# EAGLE schematic Spartan3E_DevBoard-v22 (EAGLE 5.00)
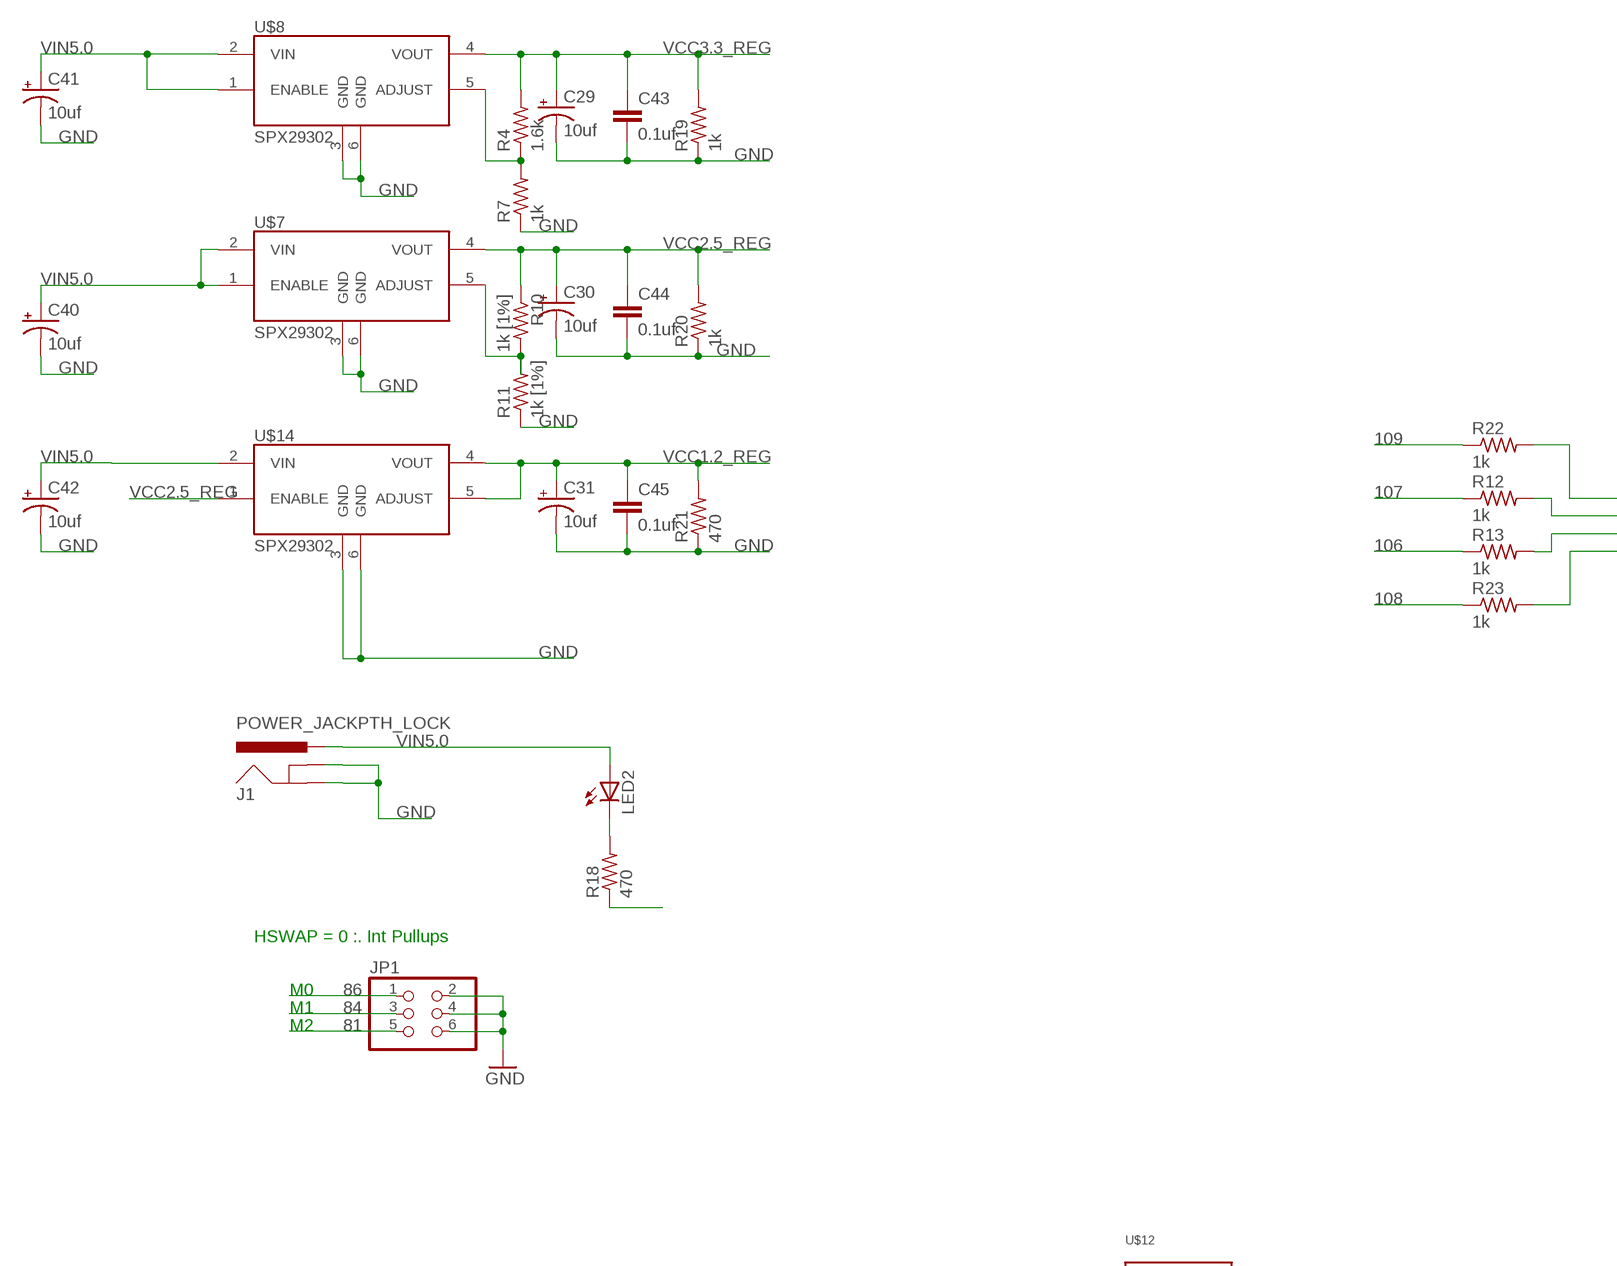
[diagram p0: schematic, sheet 1, part 1 of 3]
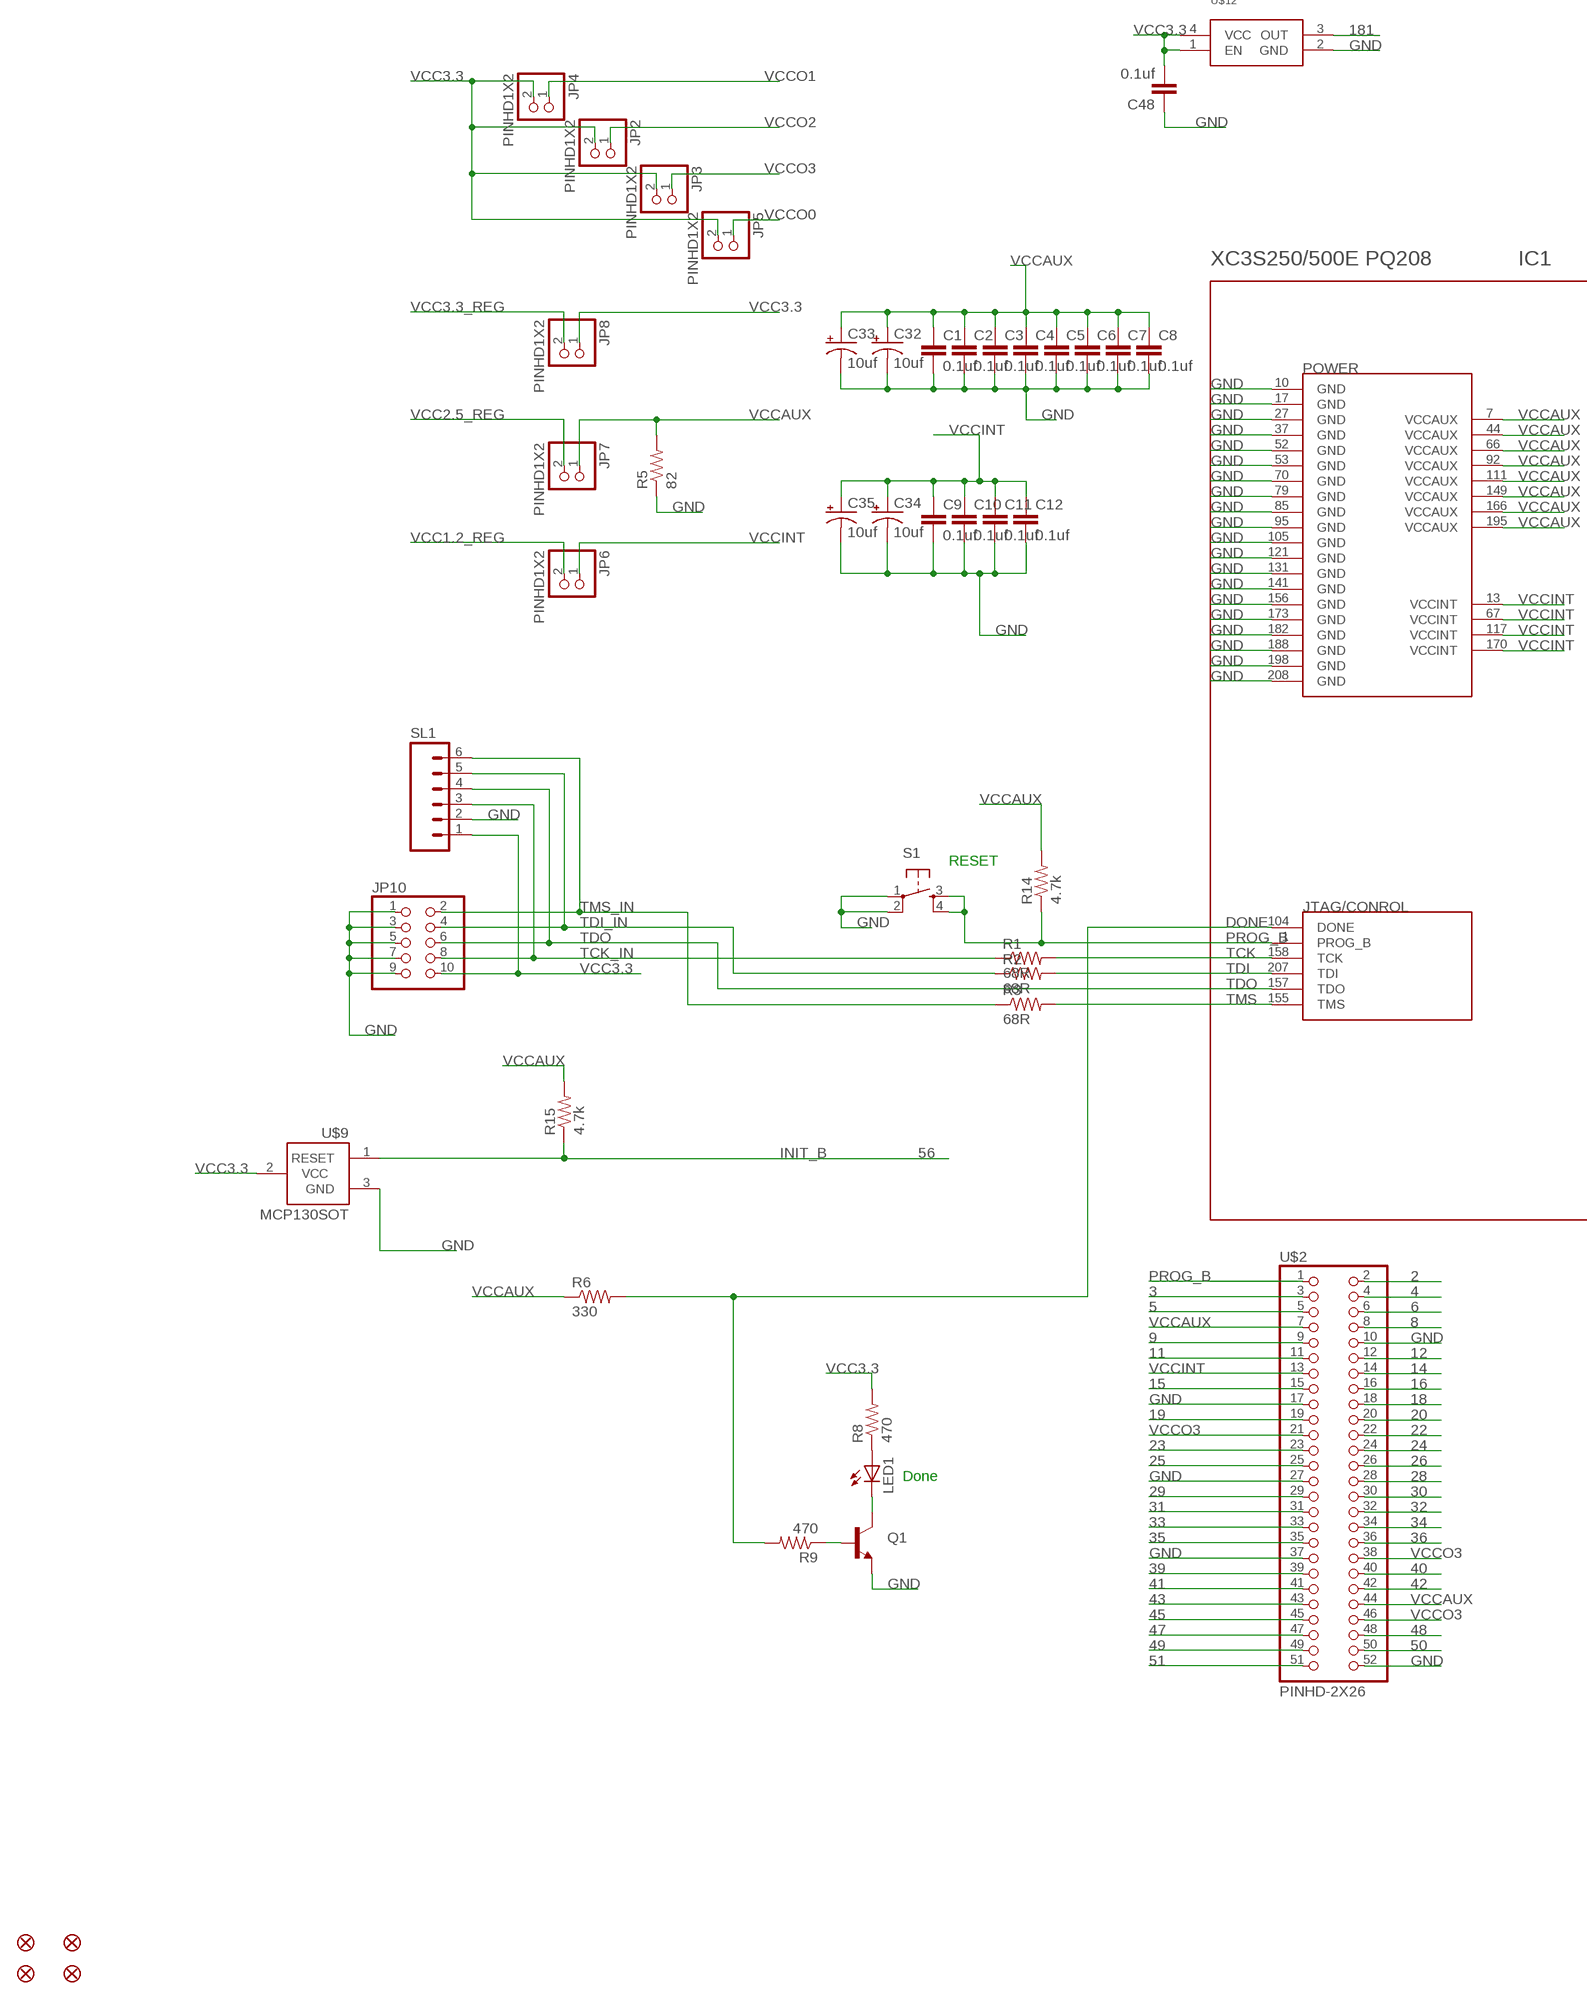
[diagram p1: schematic, sheet 1, part 2 of 3]
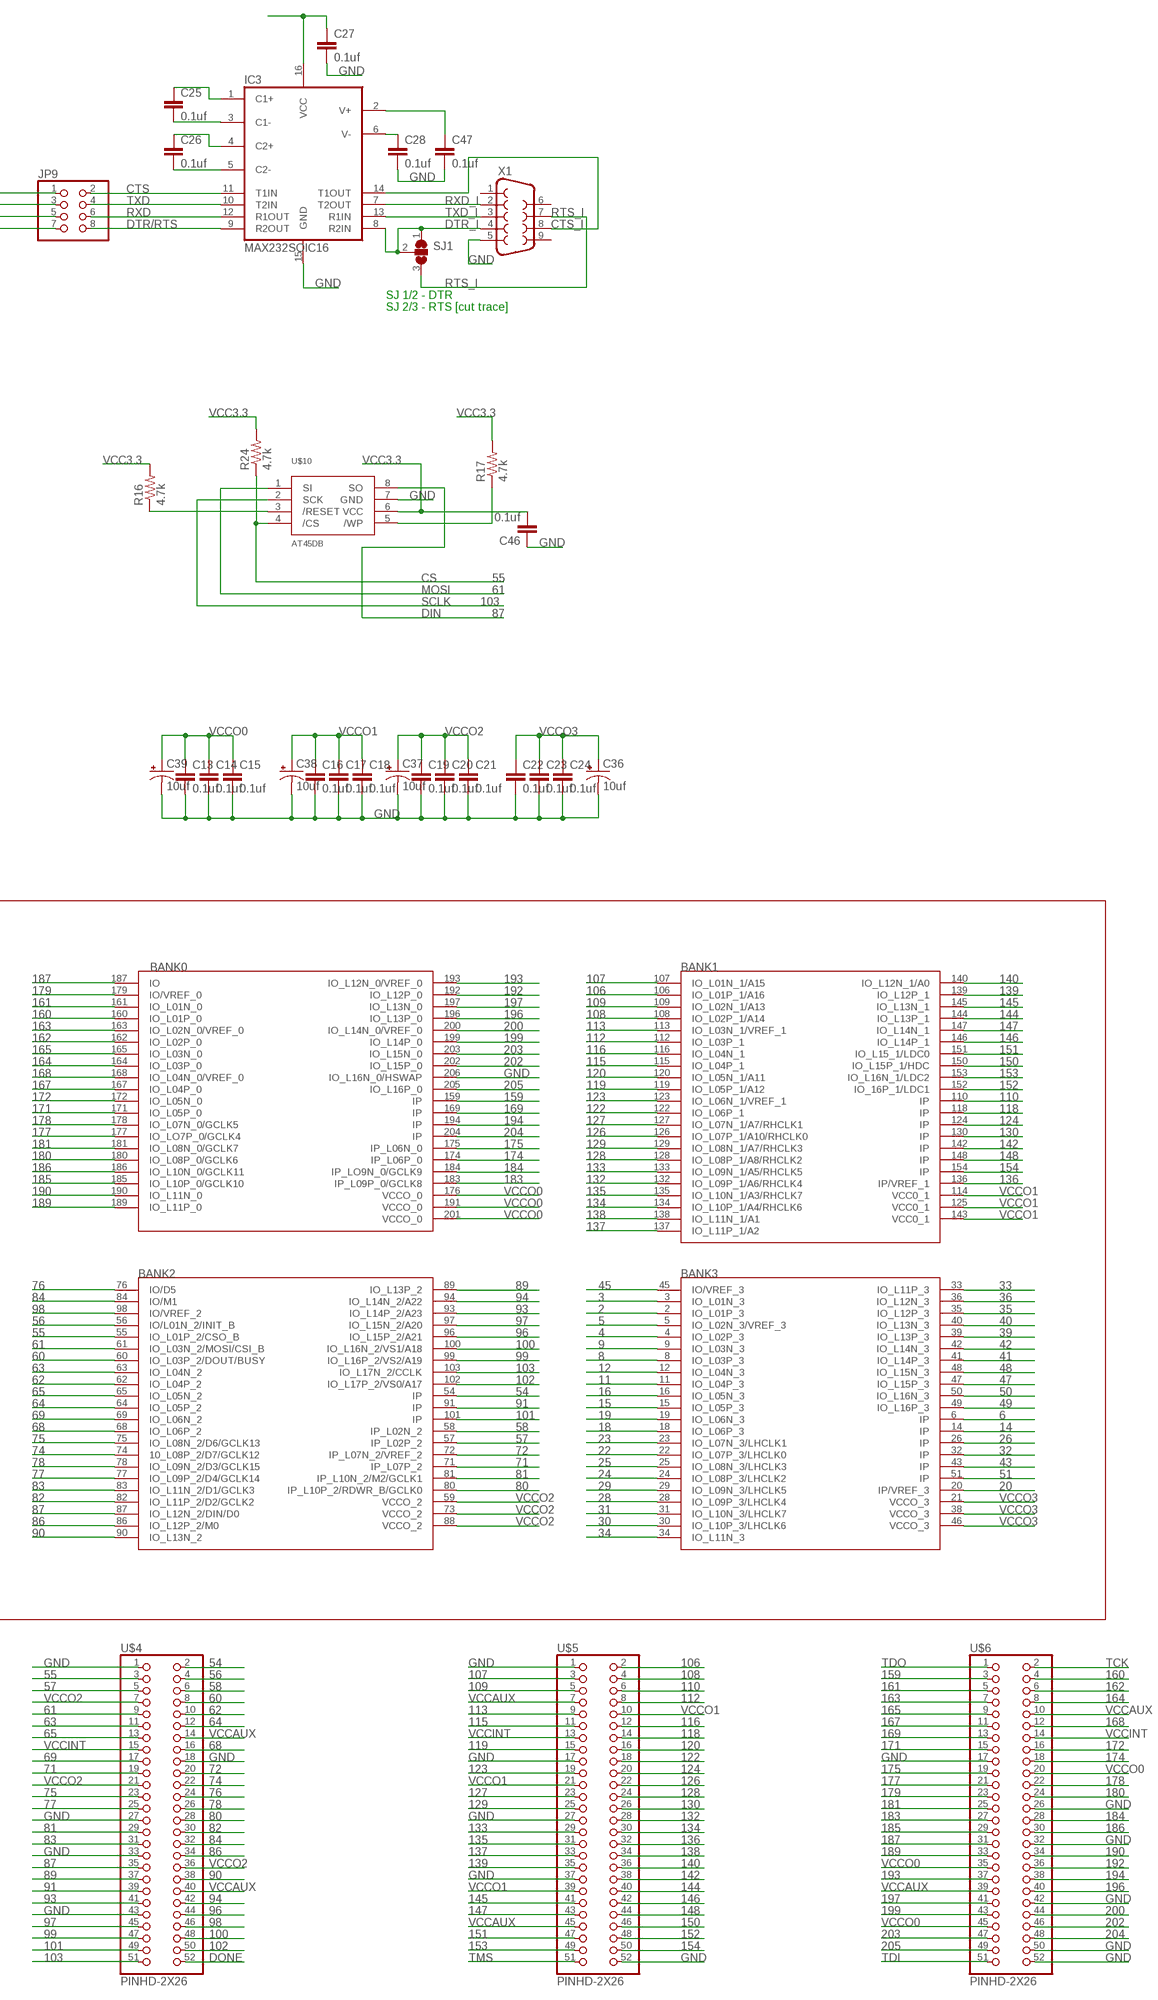
[diagram p2: schematic, sheet 1, part 3 of 3]

## Parts
C1  0.1uf  CAP0603-CAP  [0603-CAP]
C2  0.1uf  CAP0603-CAP  [0603-CAP]
C3  0.1uf  CAP0603-CAP  [0603-CAP]
C4  0.1uf  CAP0603-CAP  [0603-CAP]
C5  0.1uf  CAP0603-CAP  [0603-CAP]
C6  0.1uf  CAP0603-CAP  [0603-CAP]
C7  0.1uf  CAP0603-CAP  [0603-CAP]
C8  0.1uf  CAP0603-CAP  [0603-CAP]
C9  0.1uf  CAP0603-CAP  [0603-CAP]
C10  0.1uf  CAP0603-CAP  [0603-CAP]
C11  0.1uf  CAP0603-CAP  [0603-CAP]
C12  0.1uf  CAP0603-CAP  [0603-CAP]
C13  0.1uf  CAP0603-CAP  [0603-CAP]
C14  0.1uf  CAP0603-CAP  [0603-CAP]
C15  0.1uf  CAP0603-CAP  [0603-CAP]
C16  0.1uf  CAP0603-CAP  [0603-CAP]
C17  0.1uf  CAP0603-CAP  [0603-CAP]
C18  0.1uf  CAP0603-CAP  [0603-CAP]
C19  0.1uf  CAP0603-CAP  [0603-CAP]
C20  0.1uf  CAP0603-CAP  [0603-CAP]
C21  0.1uf  CAP0603-CAP  [0603-CAP]
C22  0.1uf  CAP0603-CAP  [0603-CAP]
C23  0.1uf  CAP0603-CAP  [0603-CAP]
C24  0.1uf  CAP0603-CAP  [0603-CAP]
C25  0.1uf  CAP0603-CAP  [0603-CAP]
C26  0.1uf  CAP0603-CAP  [0603-CAP]
C27  0.1uf  CAP0603-CAP  [0603-CAP]
C28  0.1uf  CAP0603-CAP  [0603-CAP]
C29  10uf  CAP_POL1206  [EIA3216]
C30  10uf  CAP_POL1206  [EIA3216]
C31  10uf  CAP_POL1206  [EIA3216]
C32  10uf  CAP_POL1206  [EIA3216]
C33  10uf  CAP_POL1206  [EIA3216]
C34  10uf  CAP_POL1206  [EIA3216]
C35  10uf  CAP_POL1206  [EIA3216]
C36  10uf  CAP_POL1206  [EIA3216]
C37  10uf  CAP_POL1206  [EIA3216]
C38  10uf  CAP_POL1206  [EIA3216]
C39  10uf  CAP_POL1206  [EIA3216]
C40  10uf  CAP_POL1206  [EIA3216]
C41  10uf  CAP_POL1206  [EIA3216]
C42  10uf  CAP_POL1206  [EIA3216]
C43  0.1uf  CAP0603-CAP  [0603-CAP]
C44  0.1uf  CAP0603-CAP  [0603-CAP]
C45  0.1uf  CAP0603-CAP  [0603-CAP]
C46  0.1uf  CAP0603-CAP  [0603-CAP]
C47  0.1uf  CAP0603-CAP  [0603-CAP]
C48  0.1uf  CAP0603-CAP  [0603-CAP]
IC1  XC3S250/500E-PQ208  [PQ208]
IC3  MAX232SOIC16  [SO016]
J1  POWER_JACKPTH_LOCK  [POWER_JACK_PTH_LOCK]
JP1  PINHD-2X3  [2X03]
JP2  PINHD1X2  [1X02@1]
JP3  PINHD1X2  [1X02@1]
JP4  PINHD1X2  [1X02@1]
JP5  PINHD1X2  [1X02@1]
JP6  PINHD1X2  [1X02@1]
JP7  PINHD1X2  [1X02@1]
JP8  PINHD1X2  [1X02@1]
JP9  PINHD-2X4  [2X04]
JP10  PINHD-2X5  [2X05]
LED1  LED0603  [LED-0603]
LED2  LED0603  [LED-0603]
Q1  TRANSISTOR_NPNSOT23  [SOT23]
R1  68R  RES0603  [R0603]
R2  68R  RES0603  [R0603]
R3  68R  RES0603  [R0603]
R4  1.6k  RES0603  [R0603]
R5  82  RES0603  [R0603]
R6  330  RES0603  [R0603]
R7  1k  RES0603  [R0603]
R8  470  RESISTOR0603-RES  [0603-RES]
R9  470  RESISTOR0603-RES  [0603-RES]
R10  1k [1%]  RES0603  [R0603]
R11  1k [1%]  RES0603  [R0603]
R12  1k  RES0603  [R0603]
R13  1k  RES0603  [R0603]
R14  4.7k  RES0603  [R0603]
R15  4.7k  RES0603  [R0603]
R16  4.7k  RES0603  [R0603]
R17  4.7k  RES0603  [R0603]
R18  470  RES0603  [R0603]
R19  1k  RES0603  [R0603]
R20  1k  RES0603  [R0603]
R21  470  RES0603  [R0603]
R22  1k  RES0603  [R0603]
R23  1k  RES0603  [R0603]
R24  4.7k  RES0603  [R0603]
S1  TAC_SWITCHSMD  [TACTILE_SWITCH_SMD]
SJ1  SJ2W  [SJ_2]
SL1  M06SIP  [1X06]
U$1  FIDUCIAL1X2  [FIDUCIAL-1X2]
U$2  PINHD-2X26  [2X26]
U$3  FIDUCIAL1X2  [FIDUCIAL-1X2]
U$4  PINHD-2X26  [2X26]
U$5  PINHD-2X26  [2X26]
U$6  PINHD-2X26  [2X26]
U$7  SPX29302  [Q5-DD_SPX29300]
U$8  SPX29302  [Q5-DD_SPX29300]
U$9  MCP130SOT  [SOT23-3]
U$10  AT45DB  [SO08]
U$12  3X5SMDOSC  [CRYSTAL-SMD-5X3]
U$14  SPX29302  [Q5-DD_SPX29300]
U$15  FIDUCIAL1X2  [FIDUCIAL-1X2]
U$16  FIDUCIAL1X2  [FIDUCIAL-1X2]
X1  DB9  [DB9]

## Nets
2: IC1.2(IO_L01P_3) U$2.2
3: IC1.3(IO_L01N_3) U$2.3
4: IC1.4(IO_L02P_3) U$2.4
5: IC1.5(IO_L02N_3/VREF_3) U$2.5
6: IC1.6(IP) U$2.6
8: IC1.8(IO_L03P_3) U$2.8
9: IC1.9(IO_L03N_3) U$2.9
11: IC1.11(IO_L04P_3) U$2.11
12: IC1.12(IO_L04N_3) U$2.12
14: IC1.14(IP) U$2.14
15: IC1.15(IO_L05P_3) U$2.15
16: IC1.16(IO_L05N_3) U$2.16
18: IC1.18(IO_L06P_3) U$2.18
19: IC1.19(IO_L06N_3) U$2.19
20: IC1.20(IP/VREF_3) U$2.20
22: IC1.22(IO_L07P_3/LHCLK0) U$2.22
23: IC1.23(IO_L07N_3/LHCLK1) U$2.23
24: IC1.24(IO_L08P_3/LHCLK2) U$2.24
25: IC1.25(IO_L08N_3/LHCLK3) U$2.25
26: IC1.26(IP) U$2.26
28: IC1.28(IO_L09P_3/LHCLK4) U$2.28
29: IC1.29(IO_L09N_3/LHCLK5) U$2.29
30: IC1.30(IO_L10P_3/LHCLK6) U$2.30
31: IC1.31(IO_L10N_3/LHCLK7) U$2.31
32: IC1.32(IP) U$2.32
33: IC1.33(IO_L11P_3) U$2.33
34: IC1.34(IO_L11N_3) U$2.34
35: IC1.35(IO_L12P_3) U$2.35
36: IC1.36(IO_L12N_3) U$2.36
39: IC1.39(IO_L13P_3) U$2.39
40: IC1.40(IO_L13N_3) U$2.40
41: IC1.41(IO_L14P_3) U$2.41
42: IC1.42(IO_L14N_3) U$2.42
43: IC1.43(IP) U$2.43
45: IC1.45(IO/VREF_3) U$2.45
47: IC1.47(IO_L15P_3) U$2.47
48: IC1.48(IO_L15N_3) U$2.48
49: IC1.49(IO_L16P_3) U$2.49
50: IC1.50(IO_L16N_3) U$2.50
51: IC1.51(IP) U$2.51
54: IC1.54(IP) U$4.2
55: IC1.55(IO_L01P_2/CSO_B) R24.1 U$4.3 U$10.4(/CS)
56: IC1.56(IO/L01N_2/INIT_B) R15.1 U$4.4 U$9.1(RESET)
57: IC1.57(IP_L02P_2) U$4.5
58: IC1.58(IP_L02N_2) U$4.6
60: IC1.60(IO_L03P_2/DOUT/BUSY) U$4.8
61: IC1.61(IO_L03N_2/MOSI/CSI_B) U$4.9 U$10.1(SI)
62: IC1.62(IO_L04P_2) U$4.10
63: IC1.63(IO_L04N_2) U$4.11
64: IC1.64(IO_L05P_2) U$4.12
65: IC1.65(IO_L05N_2) U$4.13
68: IC1.68(IO_L06P_2) U$4.16
69: IC1.69(IO_L06N_2) U$4.17
71: IC1.71(IP_L07P_2) U$4.19
72: IC1.72(IP_L07N_2/VREF_2) U$4.20
74: IC1.74(10_L08P_2/D7/GCLK12) U$4.22
75: IC1.75(IO_L08N_2/D6/GCLK13) U$4.23
76: IC1.76(IO/D5) U$4.24
77: IC1.77(IO_L09P_2/D4/GCLK14) U$4.25
78: IC1.78(IO_L09N_2/D3/GCLK15) U$4.26
80: IC1.80(IP_L10P_2/RDWR_B/GCLK0) U$4.28
81: IC1.81(IP_L10N_2/M2/GCLK1) JP1.5 U$4.29
82: IC1.82(IO_L11P_2/D2/GCLK2) U$4.30
83: IC1.83(IO_L11N_2/D1/GCLK3) U$4.31
84: IC1.84(IO/M1) JP1.3 U$4.32
86: IC1.86(IO_L12P_2/M0) JP1.1 U$4.34
87: IC1.87(IO_L12N_2/DIN/D0) U$4.35 U$10.8(SO)
89: IC1.89(IO_L13P_2) U$4.37
90: IC1.90(IO_L13N_2) U$4.38
91: IC1.91(IP) U$4.39
93: IC1.93(IO_L14P_2/A23) U$4.41
94: IC1.94(IO_L14N_2/A22) U$4.42
96: IC1.96(IO_L15P_2/A21) U$4.44
97: IC1.97(IO_L15N_2/A20) U$4.45
98: IC1.98(IO/VREF_2) U$4.46
99: IC1.99(IO_L16P_2/VS2/A19) U$4.47
100: IC1.100(IO_L16N_2/VS1/A18) U$4.48
101: IC1.101(IP) U$4.49
102: IC1.102(IO_L17P_2/VS0/A17) U$4.50
103: IC1.103(IO_L17N_2/CCLK) U$4.51 U$10.2(SCK)
106: IC1.106(IO_L01P_1/A16) R13.1 U$5.2
107: IC1.107(IO_L01N_1/A15) R12.1 U$5.3
108: IC1.108(IO_L02P_1/A14) R23.1 U$5.4
109: IC1.109(IO_L02N_1/A13) R22.1 U$5.5
110: IC1.110(IP) U$5.6
112: IC1.112(IO_L03P_1) U$5.8
113: IC1.113(IO_L03N_1/VREF_1) U$5.9
115: IC1.115(IO_L04P_1) U$5.11
116: IC1.116(IO_L04N_1) U$5.12
118: IC1.118(IP) U$5.14
119: IC1.119(IO_L05P_1/A12) U$5.15
120: IC1.120(IO_L05N_1/A11) U$5.16
122: IC1.122(IO_L06P_1) U$5.18
123: IC1.123(IO_L06N_1/VREF_1) U$5.19
124: IC1.124(IP) U$5.20
126: IC1.126(IO_L07P_1/A10/RHCLK0) U$5.22
127: IC1.127(IO_L07N_1/A7/RHCLK1) U$5.23
128: IC1.128(IO_L08P_1/A8/RHCLK2) U$5.24
129: IC1.129(IO_L08N_1/A7/RHCLK3) U$5.25
130: IC1.130(IP) U$5.26
132: IC1.132(IO_L09P_1/A6/RHCLK4) U$5.28
133: IC1.133(IO_L09N_1/A5/RHCLK5) U$5.29
134: IC1.134(IO_L10P_1/A4/RHCLK6) U$5.30
135: IC1.135(IO_L10N_1/A3/RHCLK7) U$5.31
136: IC1.136(IP/VREF_1) U$5.32
137: IC1.137(IO_L11P_1/A2) U$5.33
138: IC1.138(IO_L11N_1/A1) U$5.34
139: IC1.139(IO_L12P_1) U$5.35
140: IC1.140(IO_L12N_1/A0) U$5.36
142: IC1.142(IP) U$5.38
144: IC1.144(IO_L13P_1) U$5.40
145: IC1.145(IO_L13N_1) U$5.41
146: IC1.146(IO_L14P_1) U$5.42
147: IC1.147(IO_L14N_1) U$5.43
148: IC1.148(IP) U$5.44
150: IC1.150(IO_L15P_1/HDC) U$5.46
151: IC1.151(IO_L15_1/LDC0) U$5.47
152: IC1.152(IO_16P_1/LDC1) U$5.48
153: IC1.153(IO_L16N_1/LDC2) U$5.49
154: IC1.154(IP) U$5.50
159: IC1.159(IP) U$6.3
160: IC1.160(IO_L01P_0) U$6.4
161: IC1.161(IO_L01N_0) U$6.5
162: IC1.162(IO_L02P_0) U$6.6
163: IC1.163(IO_L02N_0/VREF_0) U$6.7
164: IC1.164(IO_L03P_0) U$6.8
165: IC1.165(IO_L03N_0) U$6.9
167: IC1.167(IO_L04P_0) U$6.11
168: IC1.168(IO_L04N_0/VREF_0) U$6.12
169: IC1.169(IP) U$6.13
171: IC1.171(IO_L05P_0) U$6.15
172: IC1.172(IO_L05N_0) U$6.16
174: IC1.174(IP_L06P_0) U$6.18
175: IC1.175(IP_L06N_0) U$6.19
177: IC1.177(IO_LO7P_0/GCLK4) U$6.21
178: IC1.178(IO_L07N_0/GCLK5) U$6.22
179: IC1.179(IO/VREF_0) U$6.23
180: IC1.180(IO_L08P_0/GCLK6) U$6.24
181: IC1.181(IO_L08N_0/GCLK7) U$6.25 U$12.3(OUT)
183: IC1.183(IP_L09P_0/GCLK8) U$6.27
184: IC1.184(IP_LO9N_0/GCLK9) U$6.28
185: IC1.185(IO_L10P_0/GCLK10) U$6.29
186: IC1.186(IO_L10N_0/GCLK11) U$6.30
187: IC1.187(IO) U$6.31
189: IC1.189(IO_L11P_0) U$6.33
190: IC1.190(IO_L11N_0) U$6.34
192: IC1.192(IO_L12P_0) U$6.36
193: IC1.193(IO_L12N_0/VREF_0) U$6.37
194: IC1.194(IP) U$6.38
196: IC1.196(IO_L13P_0) U$6.40
197: IC1.197(IO_L13N_0) U$6.41
199: IC1.199(IO_L14P_0) U$6.43
200: IC1.200(IO_L14N_0/VREF_0) U$6.44
202: IC1.202(IO_L15P_0) U$6.46
203: IC1.203(IO_L15N_0) U$6.47
204: IC1.204(IP) U$6.48
205: IC1.205(IO_L16P_0) U$6.49
CTS: IC3.11(T1IN) JP9.2
CTS_I: IC3.14(T1OUT) X1.8
DONE: IC1.104(DONE) R6.2 R9.2 U$4.52
DTR/RTS: IC3.9(R2OUT) JP9.8
DTR_I: IC3.8(R2IN) SJ1.1 SJ1.2 X1.4
GND: C1.2 C2.2 C3.2 C4.2 C5.2 C6.2 C7.2 C8.2 C9.2 C10.2 C11.2 C12.2 C13.2 C14.2 C15.2 C16.2 C17.2 C18.2 C19.2 C20.2 C21.2 C22.2 C23.2 C24.2 C27.2 C28.2 C29.C(-) C30.C(-) C31.C(-) C32.C(-) C33.C(-) C34.C(-) C35.C(-) C36.C(-) C37.C(-) C38.C(-) C39.C(-) C40.C(-) C41.C(-) C42.C(-) C43.2 C44.2 C45.2 C46.1 C47.2 C48.1 IC1.10(GND) IC1.17(GND) IC1.27(GND) IC1.37(GND) IC1.52(GND) IC1.53(GND) IC1.70(GND) IC1.79(GND) IC1.85(GND) IC1.95(GND) IC1.105(GND) IC1.121(GND) IC1.131(GND) IC1.141(GND) IC1.156(GND) IC1.173(GND) IC1.182(GND) IC1.188(GND) IC1.198(GND) IC1.206(IO_L16N_0/HSWAP) IC1.208(GND) IC3.15(GND) J1.GND J1.GNDBREAK JP1.2 JP1.4 JP1.6 JP10.1 JP10.3 JP10.5 JP10.7 JP10.9 Q1.2(E) R5.1 R7.1 R11.1 R18.1 R19.1 R20.1 R21.1 S1.1 S1.2 SL1.2 U$2.10 U$2.17 U$2.27 U$2.37 U$2.52 U$4.1 U$4.18 U$4.27 U$4.33 U$4.43 U$5.1 U$5.17 U$5.27 U$5.37 U$5.52 U$6.17 U$6.26 U$6.32 U$6.42 U$6.50 U$6.52 U$7.3(GND) U$7.6(GND) U$8.3(GND) U$8.6(GND) U$9.3(GND) U$10.7(GND) U$12.2(GND) U$14.3(GND) U$14.6(GND) X1.5
N$1: LED1.C Q1.3(C)
N$2: R10.2 R11.2 U$7.5(ADJUST)
N$3: LED1.A R8.1
N$4: Q1.1(B) R9.1
N$5: C47.1 IC3.2(V+)
N$6: C28.1 IC3.6(V-)
N$7: C25.1 IC3.1(C1+)
N$8: C25.2 IC3.3(C1-)
N$9: C26.1 IC3.4(C2+)
N$10: C26.2 IC3.5(C2-)
N$11: R17.1 U$10.5(/WP)
N$13: LED2.C R18.2
N$14: JP9.1 R22.2
N$15: R16.1 U$10.3(/RESET)
N$16: JP9.3 R12.2
N$17: JP9.5 R13.2
N$18: JP9.7 R23.2
N$19: R4.1 R7.2 U$8.5(ADJUST)
PROG_B: IC1.1(PROG_B) R14.1 S1.3 S1.4 U$2.1
RTS_I: SJ1.3 X1.7
RXD: IC3.12(R1OUT) JP9.6
RXD_I: IC3.7(T2OUT) X1.2
TCK: IC1.158(TCK) R1.2 U$6.2
TCK_IN: JP10.8 R1.1 SL1.3
TDI: IC1.207(TDI) R2.2 U$6.51
TDI_IN: JP10.4 R2.1 SL1.5
TDO: IC1.157(TDO) JP10.6 SL1.4 U$6.1
TMS: IC1.155(TMS) R3.2 U$5.51
TMS_IN: JP10.2 R3.1 SL1.6
TXD: IC3.10(T2IN) JP9.4
TXD_I: IC3.13(R1IN) X1.3
VCC1.2_REG: C31.A(+) C45.1 JP6.2 R21.2 U$14.4(VOUT) U$14.5(ADJUST)
VCC2.5_REG: C30.A(+) C44.1 JP7.2 R10.1 R20.2 U$7.4(VOUT) U$14.1(ENABLE)
VCC3.3: C27.1 C46.2 C48.2 IC3.16(VCC) JP2.2 JP3.2 JP4.2 JP5.2 JP8.1 JP10.10 R8.2 R16.2 R17.2 R24.2 SL1.1 U$9.2(VCC) U$10.6(VCC) U$12.1(EN) U$12.4(VCC)
VCC3.3_REG: C29.A(+) C43.1 JP8.2 R4.2 R19.2 U$8.4(VOUT)
VCCAUX: C1.1 C2.1 C3.1 C4.1 C5.1 C6.1 C7.1 C8.1 C32.A(+) C33.A(+) IC1.7(VCCAUX) IC1.44(VCCAUX) IC1.66(VCCAUX) IC1.92(VCCAUX) IC1.111(VCCAUX) IC1.149(VCCAUX) IC1.166(VCCAUX) IC1.195(VCCAUX) JP7.1 R5.2 R6.1 R14.2 R15.2 U$2.7 U$2.44 U$4.14 U$4.40 U$5.7 U$5.45 U$6.10 U$6.39
VCCINT: C9.1 C10.1 C11.1 C12.1 C34.A(+) C35.A(+) IC1.13(VCCINT) IC1.67(VCCINT) IC1.117(VCCINT) IC1.170(VCCINT) JP6.1 U$2.13 U$4.15 U$5.13 U$6.14
VCCO0: C13.1 C14.1 C15.1 C39.A(+) IC1.176(VCCO_0) IC1.191(VCCO_0) IC1.201(VCCO_0) JP5.1 U$6.20 U$6.35 U$6.45
VCCO1: C16.1 C17.1 C18.1 C38.A(+) IC1.114(VCC0_1) IC1.125(VCC0_1) IC1.143(VCC0_1) JP4.1 U$5.10 U$5.21 U$5.39
VCCO2: C19.1 C20.1 C21.1 C37.A(+) IC1.59(VCCO_2) IC1.73(VCCO_2) IC1.88(VCCO_2) JP2.1 U$4.7 U$4.21 U$4.36
VCCO3: C22.1 C23.1 C24.1 C36.A(+) IC1.21(VCCO_3) IC1.38(VCCO_3) IC1.46(VCCO_3) JP3.1 U$2.21 U$2.38 U$2.46
VIN5.0: C40.A(+) C41.A(+) C42.A(+) J1.PWR LED2.A U$7.1(ENABLE) U$7.2(VIN) U$8.1(ENABLE) U$8.2(VIN) U$14.2(VIN)
Unconnected: X1.1 X1.6 X1.9

## Notes on the sheet
- SJ 1/2 - DTR
- SJ 2/3 - RTS [cut trace]
- HSWAP = 0 :. Int Pullups
- M0
- M1
- M2
- CS
- MOSI
- SCLK
- DIN
- RESET
- INIT_B
- Done

## Library data of the parts
C1-C28 C43-C48 = SparkFun:CAP: Capacitor Standard 0603 ceramic capacitor, and 0.1" leaded capacitor.
C29-C42 = SparkFun:CAP_POL: Capacitor Polarized These are standard SMD and PTH capacitors. Normally 10uF, 47uF, and 100uF in electrolytic and tantalum varieties. Always verify the external diameter of the through hole cap, it varies with capacity, voltage, and manufacturer. The EIA devices should be standard.
IC1 = SparkFun:XC3S250/500E-PQ208
IC3 = SparkFun:MAX232: RS232 Transceiver Very common IC. This is generically called 'MAX232', but works with the 3V equivalent MAX3232 generic ICs. Field tested and mother approved. Spark Fun Electronics SKU : COM-00316 (DIP) and COM-00589 (SMD)
J1 = SparkFun:POWER_JACK: Power Jack This is the standard 5.5mm barrel jack for power. The PTH is the most common, proven, reliable, footprint. All others are experimental. The Slot footprint only works if the mill layer is transmitted to the PCB fab house so be warned. Spark Fun Electronics SKU : PRT-00119. Mating wall wart : TOL-00298 (and others)
JP1 = pinhead:PINHD-2X3: PIN HEADER
JP2-JP8 = SparkFun:PINHD1X2
JP9 = pinhead:PINHD-2X4: PIN HEADER
JP10 = pinhead:PINHD-2X5: PIN HEADER
LED1 LED2 = SparkFun:LED: LEDs Standard schematic elements and footprints for 5mm, 3mm, 1206, and 0603 sized LEDs. 5mm - Spark Fun Electronics SKU : COM-00529 (and others)
Q1 = SparkFun:TRANSISTOR_NPN: Transistor NPN BJT configuration in SOT23 package. MMBT2222 is the common NPN we use. Double check BCE configuration again layout.
R1-R7 R10-R24 = SparkFun:RES: RESISTOR
R8 R9 = SparkFun:RESISTOR: Resistor Basic schematic elements and footprints for 0603, 1206, and PTH 1/10th watt (small) resistors.
S1 = SparkFun:TAC_SWITCH: Momentary Switch Button commonly used for reset or general input. Spark Fun Electronics SKU : COM-00097
SJ1 = SparkFun:SJ2W: SMD solder JUMPER
SL1 = SparkFun:M06: Header 6 Standard 6-pin 0.1" header. Use with straight break away headers (SKU : PRT-00116), right angle break away headers (PRT-00553), swiss pins (PRT-00743), machine pins (PRT-00117), and female headers (PRT-00115). Molex polarized connector foot print use with SKU : PRT-08094 with associated crimp pins and housings. NOTES ON THE VARIANTS LOCK and LOCK_LONGPADS... This footprint was designed to help hold the alignment of a through-hole component (i.e. 6-pin header) while soldering it into place. You may notice that each hole has been shifted either up or down by 0.005 of an inch from it's more standard position (which is a perfectly straight line). This slight alteration caused the pins (the squares in the middle) to touch the edges of the holes. Because they are alternating, it causes a "brace" to hold the component in place. 0.005 has proven to be the perfect amount of "off-center" position when using our standard breakaway headers. Although looks a little odd when you look at the bare footprint, once you have a header in there, the alteration is very hard to notice. Also, if you push a header all the way into place, it is covered up entirely on the bottom side. This idea of altering the position of holes to aid alignment will be further integrated into the Sparkfun Library for other footprints. It can help hold any component with 3 or more connection pins.
U$1 U$3 U$15 U$16 = SparkFun:FIDUCIAL: Fiducial Alignment Points Various fiducial points for machine vision alignment.
U$2 U$4-U$6 = SparkFun:PINHD-2X26
U$7 U$8 U$14 = SparkFun:SPX29302
U$9 = SparkFun:MCP130
U$10 = spart3break:AT45DB
U$12 = AT91SAM9260:3X5SMDOSC
X1 = SparkFun:DB9: DB9 Connector Standard DB9 (D-Sub 9) serial connector. Can be used for CAN bus as well as RS485 and RS232. Footprint production proven. Spark Fun Electronics SKU : PRT-00429

## Net classes
0 default: width 0.254 mm